# Altium schematic sheet Power Supply.SchDoc
size A
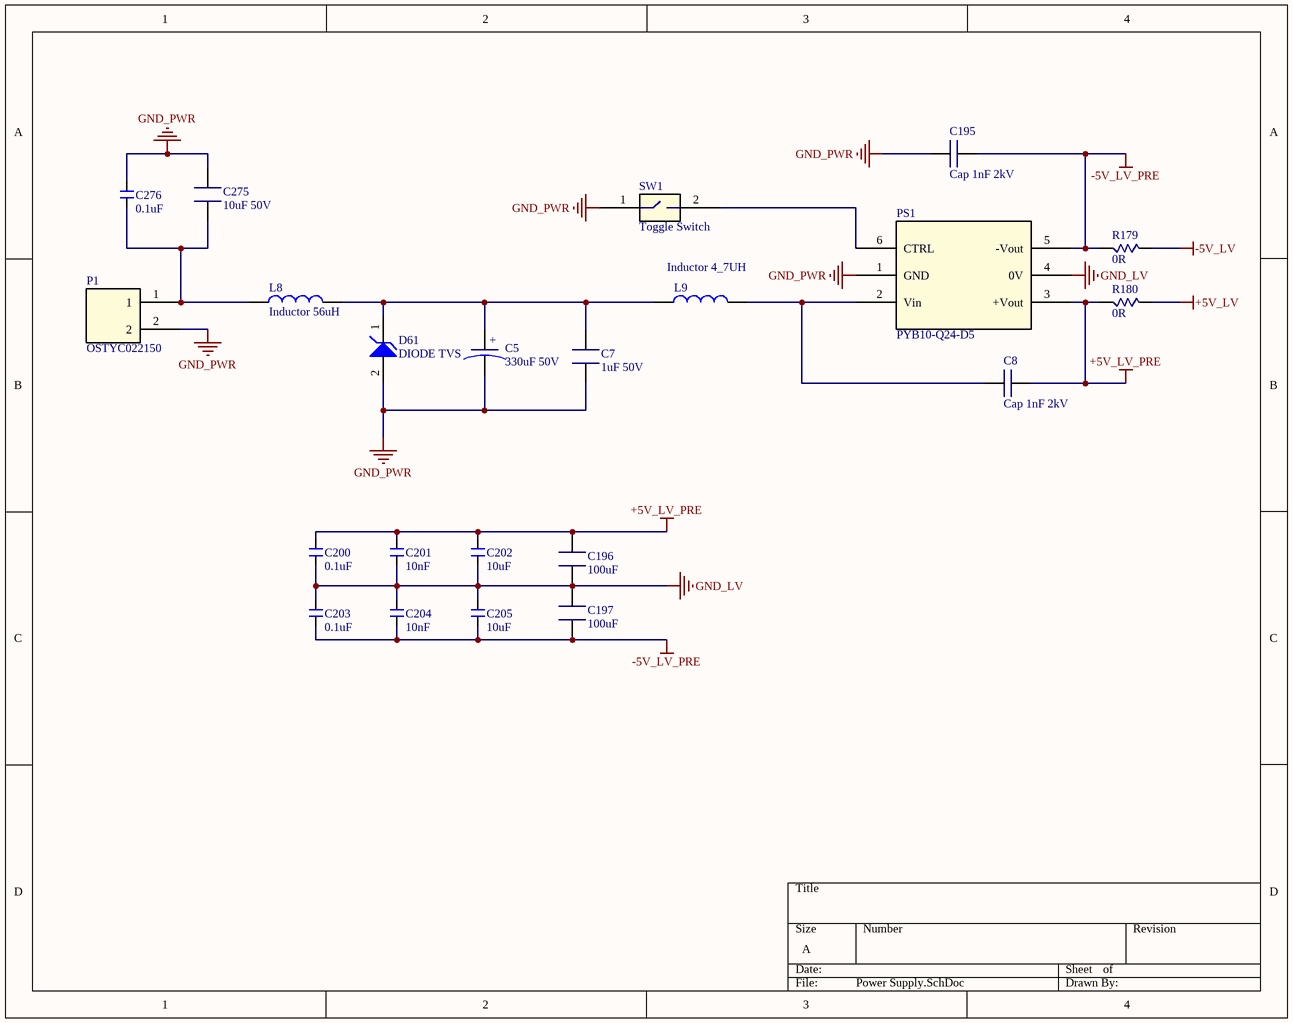
[diagram p0: Power Supply.SchDoc]

## Parts
C5  330uF 50V  [Panasonic ECA-1HM331]
C7  value 1uF 50V  [1206]  (hidden comment: Cap 1206)
C8  Cap 1nF 2kV  [1812 (4532 Metric)]
C195  Cap 1nF 2kV  [1812 (4532 Metric)]
C196  value 100uF  [1206]  (hidden comment: Cap 1206)
C197  value 100uF  [1206]  (hidden comment: Cap 1206)
C200  value 0.1uF  [0603 (1608 Metric)]  (hidden comment: Cap 0603_new)
C201  value 10nF  [0603 (1608 Metric)]  (hidden comment: Cap 0603_new)
C202  value 10uF  [0603 (1608 Metric)]  (hidden comment: Cap 0603_new)
C203  value 0.1uF  [0603 (1608 Metric)]  (hidden comment: Cap 0603_new)
C204  value 10nF  [0603 (1608 Metric)]  (hidden comment: Cap 0603_new)
C205  value 10uF  [0603 (1608 Metric)]  (hidden comment: Cap 0603_new)
C275  value 10uF 50V  [1206]  (hidden comment: Cap 1206)
C276  value 0.1uF  [0603 (1608 Metric)]  (hidden comment: Cap 0603_new)
D61  DIODE TVS  [SMCJ48A]
L8  Inductor 56uH  [Ind SM 56UH]
L9  Inductor 4_7UH  [Ind SM 4_7UH]
P1  OSTYC022150  [2 pin Terminal]
PS1  PYB10-Q24-D5  [6-DIP Module]
R179  value 0R  [1206]  (hidden comment: Resistor 1206)
R180  value 0R  [1206]  (hidden comment: Resistor 1206)
SW1  Toggle Switch  [Toggle SW]

## Nets
+5V_LV: R180.2(A)
+5V_LV_PRE: C8.2(OUT) C196.2(OUT) C200.2(OUT) C201.2(OUT) C202.2(OUT) PS1.3(+Vout) R180.1(A)
-5V_LV: R179.2(A)
-5V_LV_PRE: C195.2(OUT) C197.1(OUT) C203.1(OUT) C204.1(OUT) C205.1(OUT) PS1.5(-Vout) R179.1(A)
GND_LV: C196.1(OUT) C197.2(OUT) C200.1(OUT) C201.1(OUT) C202.1(OUT) C203.2(OUT) C204.2(OUT) C205.2(OUT) PS1.4(0V)
GND_PWR: C5.2(OUT) C7.1(OUT) C195.1(OUT) C275.2(OUT) C276.2(OUT) D61.2(Anode) P1.2 PS1.1(GND) SW1.1
NetC5_1: C5.1(OUT) C7.2(OUT) D61.1(Anode) L8.2(OUT) L9.1(OUT)
NetC8_1: C8.1(OUT) L9.2(OUT) PS1.2(Vin)
NetC275_1: C275.1(OUT) C276.1(OUT) L8.1(OUT) P1.1
NetPS1_6: PS1.6(CTRL) SW1.2

## Notes on the sheet
- (in symbol Cap Alum 330uF 50V) +

## Library data of the parts
C5 = Cap Alum 330uF 50V: Capacitor Aluminum 330uF 50V; Part: P5184-ND
C7 = Cap 1206: CAP CER 1UF 50V X7R 1206; Part: 1276-1068-1-ND
C8 C195 = Cap 3kV 220pF: CAP CER 1000PF 2KV X7R 1812; Part: 399-3447-1-ND
C196 C197 = Cap 1206: CAP CER 100UF 10V JB 1206; Part: 445-11682-1-ND
C200 C203 C276 = Cap 0603_new: CAP CER 0.1UF 50V Y5V 0603; part: 311-1343-6-ND
C201 C204 = Cap 0603_new: CAP CER 0603 10NF 50V U2J 5%; part: 399-13384-1-ND
C202 C205 = Cap 0603_new: CAP CER 10UF 35V X5R 0805; part: 490-10515-1-ND
C275 = Cap 1206: CAP CER 10UF 50V X5R 1206; Part: 587-3248-1-ND
D61 = DIODE TVS: Part: 495-2402-ND; Value: *
L8 = Inductor 10uH: FIXED IND 56UH 700MA 481 MOHM; Part: 732-4102-1-ND
L9 = Inductor 10uH: FIXED IND 4.7UH 1.2A 105 MOHM; Part: 732-1008-1-ND
P1 = 2 pin Terminal: Part: ED2902-ND
PS1 = PYB10-Q24-D5: DC/DC CONVERTER +/-5V 10W; Part: 102-2849-ND
SW1 = Toggle Switch: Part: 360-3289-ND
R179 R180 = Resistor 1206: Part: *